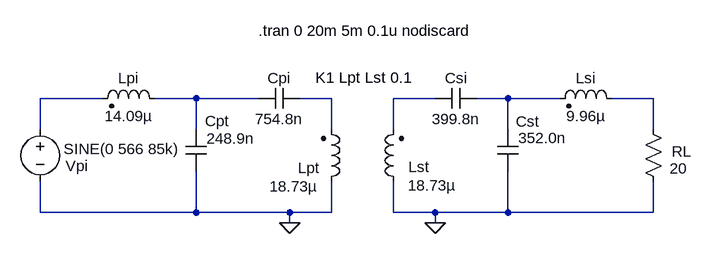
[diagram p0: schematic DesLCLLCL_2kW.asc]
DesLCLLCL_2kW.asc, the LTspice schematic file:
Version 4
SHEET 1 932 680
WIRE -96 240 -192 240
WIRE 48 240 -16 240
WIRE 144 240 48 240
WIRE 256 240 208 240
WIRE 416 240 352 240
WIRE 528 240 480 240
WIRE 608 240 528 240
WIRE 752 240 688 240
WIRE -192 288 -192 240
WIRE 48 288 48 240
WIRE 256 288 256 240
WIRE 352 288 352 240
WIRE 528 288 528 240
WIRE 752 288 752 240
WIRE -192 416 -192 368
WIRE 48 416 48 352
WIRE 48 416 -192 416
WIRE 192 416 48 416
WIRE 256 416 256 368
WIRE 256 416 192 416
WIRE 352 416 352 368
WIRE 416 416 352 416
WIRE 528 416 528 352
WIRE 528 416 416 416
WIRE 752 416 752 368
WIRE 752 416 528 416
WIRE 192 432 192 416
WIRE 416 432 416 416
FLAG 192 432 0
FLAG 416 432 0
SYMBOL ind2 240 384 M180
WINDOW 0 -35 37 Left 2
WINDOW 3 -79 8 Left 2
SYMATTR InstName Lpt
SYMATTR Value 18.73µ
SYMATTR Type ind
SYMATTR SpiceLine Rser=25m
SYMBOL ind2 368 384 R180
WINDOW 0 -39 38 Left 2
WINDOW 3 -80 10 Left 2
SYMATTR InstName Lst
SYMATTR Value 18.73µ
SYMATTR Type ind
SYMATTR SpiceLine Rser=50m
SYMBOL res 736 272 R0
WINDOW 0 44 50 Left 2
WINDOW 3 41 76 Left 2
SYMATTR InstName RL
SYMATTR Value 20
SYMBOL cap 544 352 R180
WINDOW 0 -32 76 Left 2
WINDOW 3 -74 51 Left 2
SYMATTR InstName Cst
SYMATTR Value 352.0n
SYMBOL cap 64 352 R180
WINDOW 0 -35 77 Left 2
WINDOW 3 -74 50 Left 2
SYMATTR InstName Cpt
SYMATTR Value 248.9n
SYMBOL voltage -192 272 R0
WINDOW 0 39 72 Left 2
WINDOW 3 36 46 Left 2
SYMATTR InstName Vpi
SYMATTR Value SINE(0 566 85k)
SYMBOL ind2 0 256 M270
WINDOW 0 32 56 VTop 2
WINDOW 3 4 56 VBottom 2
SYMATTR InstName Lpi
SYMATTR Value 14.09µ
SYMATTR Type ind
SYMBOL cap 144 256 R270
WINDOW 0 32 32 VTop 2
WINDOW 3 0 32 VBottom 2
SYMATTR InstName Cpi
SYMATTR Value 754.8n
SYMBOL ind2 704 256 M270
WINDOW 0 32 56 VTop 2
WINDOW 3 4 56 VBottom 2
SYMATTR InstName Lsi
SYMATTR Value 9.96µ
SYMATTR Type ind
SYMBOL cap 416 256 R270
WINDOW 0 32 32 VTop 2
WINDOW 3 0 32 VBottom 2
SYMATTR InstName Csi
SYMATTR Value 399.8n
TEXT 232 208 Left 2 !K1 Lpt Lst 0.1
TEXT 144 136 Left 2 !.tran 0 20m 5m 0.1u nodiscard

The netlist it stands for:
* DesLCLLCL_2kW.asc
Lpt 0 N003 18.73µ Rser=25m
Lst 0 N004 18.73µ Rser=50m
RL N006 0 20
Cst 0 N005 352.0n
Cpt 0 N002 248.9n
Vpi N001 0 SINE(0 566 85k)
Lpi N002 N001 14.09µ
Cpi N002 N003 754.8n
Lsi N006 N005 9.96µ
Csi N004 N005 399.8n
K1 Lpt Lst 0.1
.tran 0 20m 5m 0.1u nodiscard
.backanno
.end